# Altium project DCR.PrjPcb
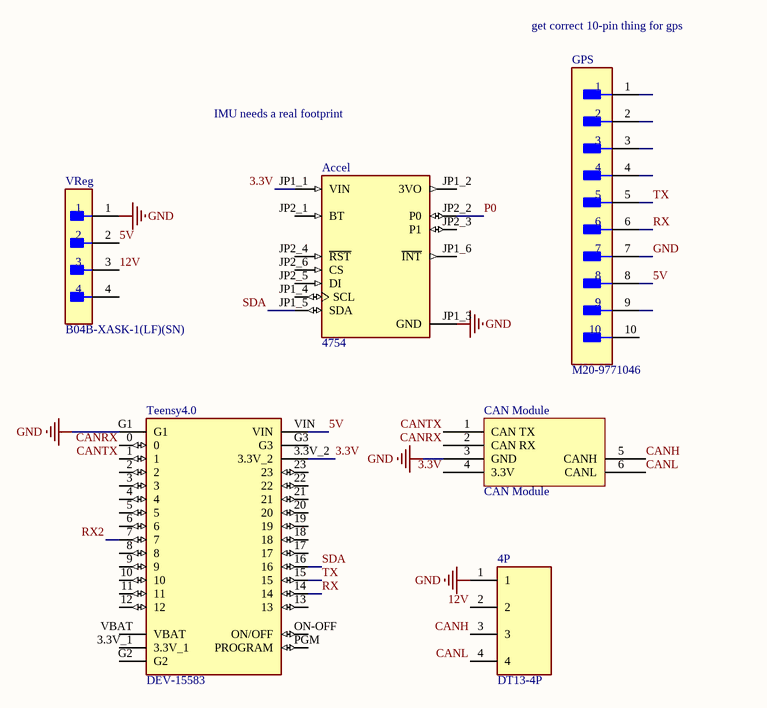
[diagram p0: DCR.SchDoc]
1 sheet, 6 parts. Net scope: global (net labels, ports and power ports of the same name join across sheets).
Board file: DCR.PcbDoc

## Sheet DCR.SchDoc
size A; SheetNumber: 1; SheetTotal: 1

### Parts
4P  DT13-4P  [TE_DT13-4P]
Accel  4754  [MODULE_4754]
CAN_Module  CAN Module  [CAN Module-Footprint-1]
GPS  M20-9771046  [FP-M20-9771046-MFG]
Teensy4.0  DEV-15583  [MODULE_DEV-15583]
VReg  B04B-XASK-1(LF)(SN)  [FP-B04B-XASK-1_LF_SN-MFG]

### Nets
GND: 4P.1 Accel.JP1_3(GND) CAN_Module.3(GND) GPS.7 Teensy4.0.G1 VReg.1
3.3V: Accel.JP1_1(VIN) CAN_Module.4(3.3V) Teensy4.0.3.3V_2
5V: GPS.8 Teensy4.0.VIN VReg.2
12V: 4P.2 VReg.3
CANH: 4P.3 CAN_Module.5(CANH)
CANL: 4P.4 CAN_Module.6(CANL)
CANRX: CAN_Module.2(CAN_RX) Teensy4.0.0
CANTX: CAN_Module.1(CAN_TX) Teensy4.0.1
P0: Accel.JP2_2(P0)
RX: GPS.6 Teensy4.0.14
RX2: Teensy4.0.7
SDA: Accel.JP1_5(SDA) Teensy4.0.16
TX: GPS.5 Teensy4.0.15

Not connected (* = marked no-connect by the designer): Accel JP1_2(3VO) JP1_4(SCL) JP1_6(~{INT}) JP2_1(BT) JP2_3(P1) JP2_4(~{RST}) JP2_5(DI) JP2_6(CS); GPS 1 2 3 4 9 10; Teensy4.0 2 3 3.3V_1 4 5 6 8 9 10 11 12 13 17 18 19 20 21 22 23 G2 G3 ON-OFF(ON/OFF) PGM(PROGRAM) VBAT; VReg 4

### Notes on the sheet
- get correct 10-pin thing for gps
- IMU needs a real footprint

### Library data of the parts
4P = DT13-4P: DT13 Series, 4.44mm Pitch 4 Way 2 Row Right Angle PCB Header, Solder Termination; MF: TE Connectivity; SnapEDA_Link: https://www.snapeda.com/parts/DT13-4P/TE%20Connectivity%20Deutsch%20Connectors/view-part/2708791/?ref=snap; MP: DT13-4P; TE_purchase_URL: https://www.te.com/usa-en/product-DT13-4P.html?te_bu=Cor&te_type=disp&te_campaign=seda_glo_cor-seda-global-disp-prtnr-fy19-seda-model-bom-cta_sma-317_1&elqCampaignId=32493; Availability: Unavailable; Value: *; Price: None; Package: None
Accel = 4754: Adafruit 9-DOF Orientation IMU Fusion Breakout - BNO085 (BNO080) - STEMMA QT / Qwiic; MP: 4754; SnapEDA_Link: https://www.snapeda.com/parts/4754/Adafruit+Industries/view-part/?ref=snap; Price: None; Purchase-URL: https://pricing.snapeda.com/search/part/4754/?ref=eda; MF: Adafruit; Package: None; Availability: In Stock; Check_prices: https://www.snapeda.com/parts/4754/Adafruit+Industries/view-part/?ref=eda; Value: *
CAN_Module = CMP-00030-00003-1: CAN waveshare
GPS = CMP-15831-000029-1: CONN HEADER VERT 10POS 2.54MM; Gender: Male; Number of Positions: 10; Connector Type: Male Pin; Voltage Rating: 750V; Current Rating: 3A; Contact Plating: Tin; Mount: Through Hole; Radiation Hardening: No; Packaging: Bulk; Pitch: 2.54mm; Number of Rows: 1; Series: M20; Contact Type: Male Pin; Color: Black; Package Quantity: 500; Contact Mating Length: 0.228inch; Case/Package: SIL; Termination: Solder; Number of Contacts: 10; Housing Material: Nylon; Contact Material: Brass
Teensy4.0 = DEV-15583: RT1062 Teensy 4.0 i.MX ARMÂ® CortexÂ®-M7 MPU Embedded Evaluation Board; MF: SparkFun Electronics; Value: *; Package: None; Digi-Key_Part_Number: 1568-DEV-15583-ND; Digi-Key_Purchase_URL: https://www.digikey.com/product-detail/en/sparkfun-electronics/DEV-15583/1568-DEV-15583-ND/10384551?utm_source=snapeda&utm_medium=aggregator&utm_campaign=symbol; MP: DEV-15583; SnapEDA_Link: https://www.snapeda.com/parts/DEV-15583/SparkFun%20Electronics/view-part/4001229/?ref=snap
VReg = CMP-17439-000018-1: CONN HEADER VERT 4POS 2.5MM; Manufacturer: JST; Current Rating: 3A; Voltage Rating: 250V; Conn Orientation: Straight; Conn Gender: Male; Number Of Contacts: 4; ComponentLink2Description: Datasheet; Package: B04B-XASK-1(LF)(SN); Octopart: https://octopart.com/b04b-xask-1%28lf%29%28sn%29-jst-3990149; Pitch: 2.5mm; Device Class L1: Connectors; RoHS: TRUE; Device Class L3: unset; Manufacturer Part Number: B04B-XASK-1(LF)(SN); Temperature Range High: +85°C; Height: 8.8mm; Lead Free: Yes; Category: Conn; Temperature: -25°C to +85°C; Digikey Description: CONN HEADER VERT 4POS 2.5MM; Temperature Range Low: -25°C; ComponentLink2URL: http://www.jst-mfg.com/product/pdf/eng/eXA1.pdf; Contact Material: Tin,Copper; Device Class L2: Headers and Wire Housings; Automotive: No; Number Of Rows: 1